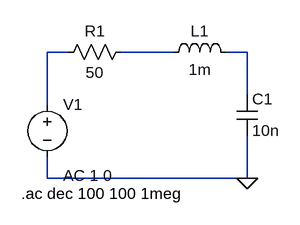
[diagram p0: schematic fig2.asc]
fig2.asc, the LTspice schematic file:
Version 4.1
SHEET 1 880 680
WIRE 80 64 48 64
WIRE 240 64 160 64
WIRE 352 64 320 64
WIRE 352 128 352 64
WIRE 48 144 48 64
WIRE 48 256 48 224
WIRE 352 256 352 192
WIRE 352 256 48 256
FLAG 352 256 0
SYMBOL voltage 48 128 R0
WINDOW 123 24 124 Left 2
WINDOW 39 0 0 Left 0
SYMATTR Value2 AC 1 0
SYMATTR InstName V1
SYMATTR Value ""
SYMBOL res 176 48 R90
WINDOW 0 0 56 VBottom 2
WINDOW 3 32 56 VTop 2
SYMATTR InstName R1
SYMATTR Value 50
SYMBOL ind 224 80 R270
WINDOW 0 32 56 VTop 2
WINDOW 3 5 56 VBottom 2
SYMATTR InstName L1
SYMATTR Value 1m
SYMATTR SpiceLine Rser=0
SYMBOL cap 336 128 R0
SYMATTR InstName C1
SYMATTR Value 10n
TEXT 8 280 Left 2 !.ac dec 100 100 1meg

The netlist it stands for:
* fig2.asc
V1 N001 0 AC 1 0
R1 N002 N001 50
L1 N002 N003 1m Rser=0
C1 N003 0 10n
.ac dec 100 100 1meg
.backanno
.end